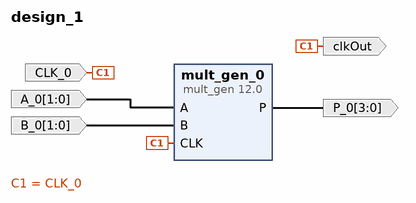
[diagram p0: block diagram of the top level]
# Vivado block design design_1, xc7z020clg484-1, Vivado 2018.2
create_bd_design design_1

create_bd_port -dir I -from 1 -to 0 -type data A_0
create_bd_port -dir I -from 1 -to 0 -type data B_0
create_bd_port -dir I -type clk CLK_0
set_property -dict {CONFIG.FREQ_HZ 10000000} [get_bd_ports CLK_0]
create_bd_port -dir O -from 3 -to 0 -type data P_0
create_bd_port -dir O -type clk clkOut

create_bd_cell -type ip -vlnv xilinx.com:ip:mult_gen:12.0 mult_gen_0
set_property -dict [list \
  CONFIG.PortAType Unsigned \
  CONFIG.PortAWidth 2 \
  CONFIG.PortBType Unsigned \
  CONFIG.PortBWidth 2 \
] [get_bd_cells mult_gen_0]

# ---- connections ----

connect_bd_net -net A_0_1 [get_bd_ports A_0] [get_bd_pins mult_gen_0/A]
connect_bd_net -net CLK_0_1 [get_bd_ports CLK_0] [get_bd_pins mult_gen_0/CLK] [get_bd_ports clkOut]
connect_bd_net [get_bd_pins mult_gen_0/P] [get_bd_ports P_0]
connect_bd_net -net B_0_1 [get_bd_ports B_0] [get_bd_pins mult_gen_0/B]

validate_bd_design
save_bd_design
